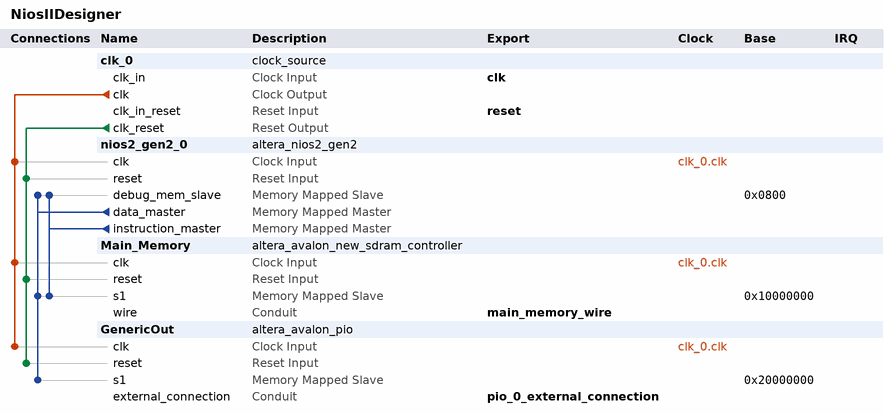
[diagram p0: system contents]
# Platform Designer (Qsys) system NiosIIDesigner, Cyclone V 5CSEMA5F31C6
# Parameters at their usual value, and those the tool derives, are not listed.
package require -exact qsys 20.1
create_system NiosIIDesigner
set_project_property DEVICE_FAMILY {Cyclone V}
set_project_property DEVICE 5CSEMA5F31C6

add_instance clk_0 clock_source 20.1
set_instance_parameter_value clk_0 clockFrequency 50000000

add_instance nios2_gen2_0 altera_nios2_gen2 20.1
set_instance_parameter_value nios2_gen2_0 dcache_size 0
set_instance_parameter_value nios2_gen2_0 exceptionSlave nios2_gen2_0.debug_mem_slave
set_instance_parameter_value nios2_gen2_0 icache_size 0
set_instance_parameter_value nios2_gen2_0 impl Fast
set_instance_parameter_value nios2_gen2_0 resetSlave nios2_gen2_0.debug_mem_slave

add_instance Main_Memory altera_avalon_new_sdram_controller 20.1
set_instance_parameter_value Main_Memory TAC 5.5
set_instance_parameter_value Main_Memory TRCD 20.0
set_instance_parameter_value Main_Memory TRP 20.0
set_instance_parameter_value Main_Memory casLatency 3
set_instance_parameter_value Main_Memory columnWidth 8
set_instance_parameter_value Main_Memory dataWidth 32
set_instance_parameter_value Main_Memory generateSimulationModel false
set_instance_parameter_value Main_Memory model single_Micron_MT48LC4M32B2_7_chip
set_instance_parameter_value Main_Memory numberOfBanks 4
set_instance_parameter_value Main_Memory numberOfChipSelects 1
set_instance_parameter_value Main_Memory powerUpDelay 100.0
set_instance_parameter_value Main_Memory refreshPeriod 15.625
set_instance_parameter_value Main_Memory rowWidth 12

add_instance GenericOut altera_avalon_pio 20.1
set_instance_parameter_value GenericOut direction Output
set_instance_parameter_value GenericOut width 32

# connections
add_connection clk_0.clk GenericOut.clk clock
add_connection clk_0.clk Main_Memory.clk clock
add_connection clk_0.clk nios2_gen2_0.clk clock
add_connection clk_0.clk_reset GenericOut.reset reset
add_connection clk_0.clk_reset Main_Memory.reset reset
add_connection clk_0.clk_reset nios2_gen2_0.reset reset
add_connection nios2_gen2_0.data_master GenericOut.s1 avalon
set_connection_parameter_value nios2_gen2_0.data_master/GenericOut.s1 baseAddress 0x20000000
add_connection nios2_gen2_0.data_master Main_Memory.s1 avalon
set_connection_parameter_value nios2_gen2_0.data_master/Main_Memory.s1 baseAddress 0x10000000
add_connection nios2_gen2_0.data_master nios2_gen2_0.debug_mem_slave avalon
set_connection_parameter_value nios2_gen2_0.data_master/nios2_gen2_0.debug_mem_slave baseAddress 0x0800
add_connection nios2_gen2_0.instruction_master Main_Memory.s1 avalon
set_connection_parameter_value nios2_gen2_0.instruction_master/Main_Memory.s1 baseAddress 0x10000000
add_connection nios2_gen2_0.instruction_master nios2_gen2_0.debug_mem_slave avalon
set_connection_parameter_value nios2_gen2_0.instruction_master/nios2_gen2_0.debug_mem_slave baseAddress 0x0800

# exported interfaces
add_interface clk clock sink
set_interface_property clk EXPORT_OF clk_0.clk_in
add_interface main_memory_wire conduit end
set_interface_property main_memory_wire EXPORT_OF Main_Memory.wire
add_interface pio_0_external_connection conduit end
set_interface_property pio_0_external_connection EXPORT_OF GenericOut.external_connection
add_interface reset reset sink
set_interface_property reset EXPORT_OF clk_0.clk_in_reset

set_interconnect_requirement {$system} qsys_mm.clockCrossingAdapter HANDSHAKE
set_interconnect_requirement {$system} qsys_mm.enableEccProtection FALSE
set_interconnect_requirement {$system} qsys_mm.insertDefaultSlave FALSE
set_interconnect_requirement {$system} qsys_mm.maxAdditionalLatency 1

save_system NiosIIDesigner.qsys
